# Altium project LED1.PrjPcb
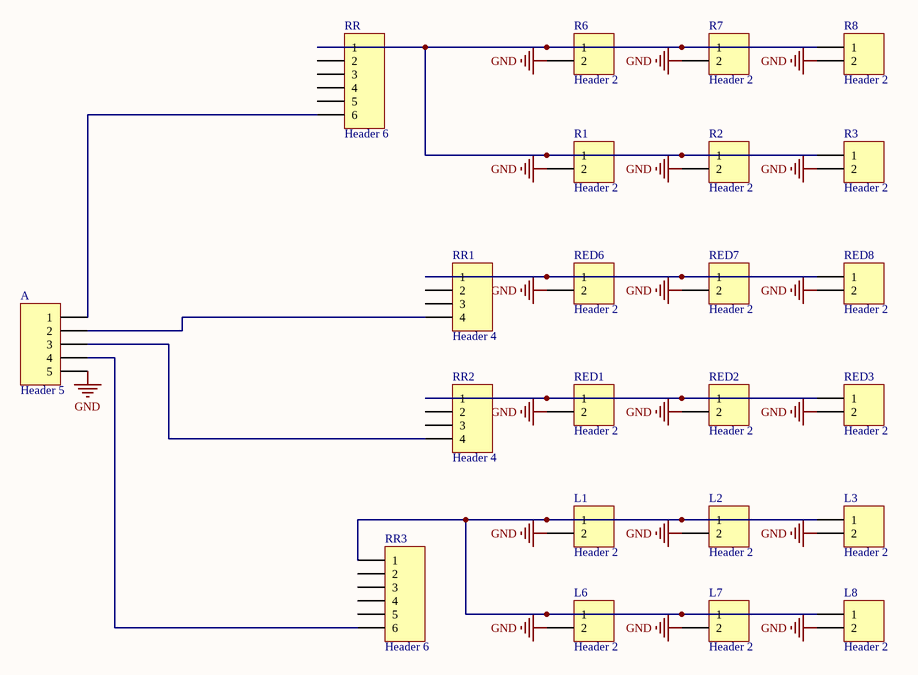
[diagram p0: LED1.SchDoc]
1 sheet, 23 parts. Net scope: global (net labels, ports and power ports of the same name join across sheets).
Board file: LED1.PcbDoc

## Sheet LED1.SchDoc
size A4

### Parts
A  Header 5  [HDR1X5]
L1  Header 2  [HDR1X2]
L2  Header 2  [HDR1X2]
L3  Header 2  [HDR1X2]
L6  Header 2  [HDR1X2]
L7  Header 2  [HDR1X2]
L8  Header 2  [HDR1X2]
R1  Header 2  [HDR1X2]
R2  Header 2  [HDR1X2]
R3  Header 2  [HDR1X2]
R6  Header 2  [HDR1X2]
R7  Header 2  [HDR1X2]
R8  Header 2  [HDR1X2]
RED1  Header 2  [HDR1X2]
RED2  Header 2  [HDR1X2]
RED3  Header 2  [HDR1X2]
RED6  Header 2  [HDR1X2]
RED7  Header 2  [HDR1X2]
RED8  Header 2  [HDR1X2]
RR  Header 6  [HDR1X6]
RR1  Header 4  [HDR1X4]
RR2  Header 4  [HDR1X4]
RR3  Header 6  [HDR1X6]

### Nets
GND: A.5 L1.2 L2.2 L3.2 L6.2 L7.2 L8.2 R1.2 R2.2 R3.2 R6.2 R7.2 R8.2 RED1.2 RED2.2 RED3.2 RED6.2 RED7.2 RED8.2
NetA_1: A.1 RR.6
NetA_2: A.2 RR1.4
NetA_3: A.3 RR2.4
NetA_4: A.4 RR3.6
NetL1_1: L1.1 L2.1 L3.1 L6.1 L7.1 L8.1 RR3.1
NetR1_1: R1.1 R2.1 R3.1 R6.1 R7.1 R8.1 RR.1
NetRED1_1: RED1.1 RED2.1 RED3.1 RR2.1
NetRED6_1: RED6.1 RED7.1 RED8.1 RR1.1

Not connected (* = marked no-connect by the designer): RR 2 3 4 5; RR1 2 3; RR2 2 3; RR3 2 3 4 5

### Library data of the parts
A = Header 5: Header, 5-Pin; LatestRevisionDate: 17-Jul-2002; LatestRevisionNote: Re-released for DXP Platform.; Publisher: Altium Limited
L1-L3 L6-L8 R1-R3 R6-R8 RED1-RED3 RED6-RED8 = Header 2: Header, 2-Pin; LatestRevisionDate: 17-Jul-2002; LatestRevisionNote: Re-released for DXP Platform.; Publisher: Altium Limited
RR RR3 = Header 6: Header, 6-Pin; LatestRevisionDate: 17-Jul-2002; LatestRevisionNote: Re-released for DXP Platform.; Publisher: Altium Limited
RR1 RR2 = Header 4: Header, 4-Pin; LatestRevisionDate: 17-Jul-2002; LatestRevisionNote: Re-released for DXP Platform.; Publisher: Altium Limited